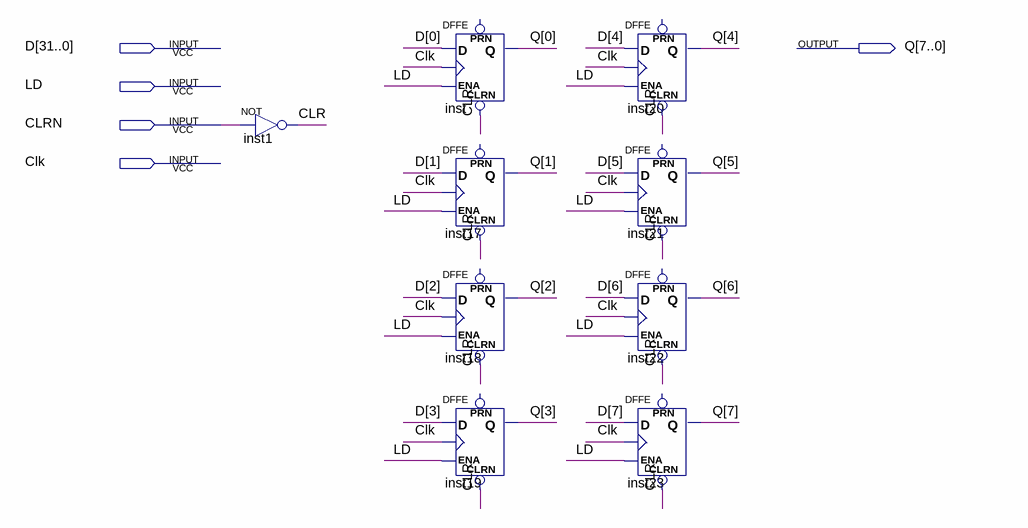
[diagram p0: schematic sheet]
// Quartus schematic reg8bit.bdf as structural Verilog: 9 symbols, 5 pins
module reg8bit (
  input  [31:0] D,
  input  LD,
  input  CLRN,
  input  Clk,
  output [7:0] Q
);

  wire CLR;

  not inst1 (CLR, CLRN);
  DFFE inst (.CLRN(CLR), .D(D[0]), .CLK(Clk), .ENA(LD), .Q(Q[0]));  // open: PRN
  DFFE inst17 (.CLRN(CLR), .D(D[1]), .CLK(Clk), .ENA(LD), .Q(Q[1]));  // open: PRN
  DFFE inst18 (.CLRN(CLR), .D(D[2]), .CLK(Clk), .ENA(LD), .Q(Q[2]));  // open: PRN
  DFFE inst19 (.CLRN(CLR), .D(D[3]), .CLK(Clk), .ENA(LD), .Q(Q[3]));  // open: PRN
  DFFE inst20 (.CLRN(CLR), .D(D[4]), .CLK(Clk), .ENA(LD), .Q(Q[4]));  // open: PRN
  DFFE inst21 (.CLRN(CLR), .D(D[5]), .CLK(Clk), .ENA(LD), .Q(Q[5]));  // open: PRN
  DFFE inst22 (.CLRN(CLR), .D(D[6]), .CLK(Clk), .ENA(LD), .Q(Q[6]));  // open: PRN
  DFFE inst23 (.CLRN(CLR), .D(D[7]), .CLK(Clk), .ENA(LD), .Q(Q[7]));  // open: PRN
endmodule
